# Altium schematic sheet meshBoard.SchDoc
size A0
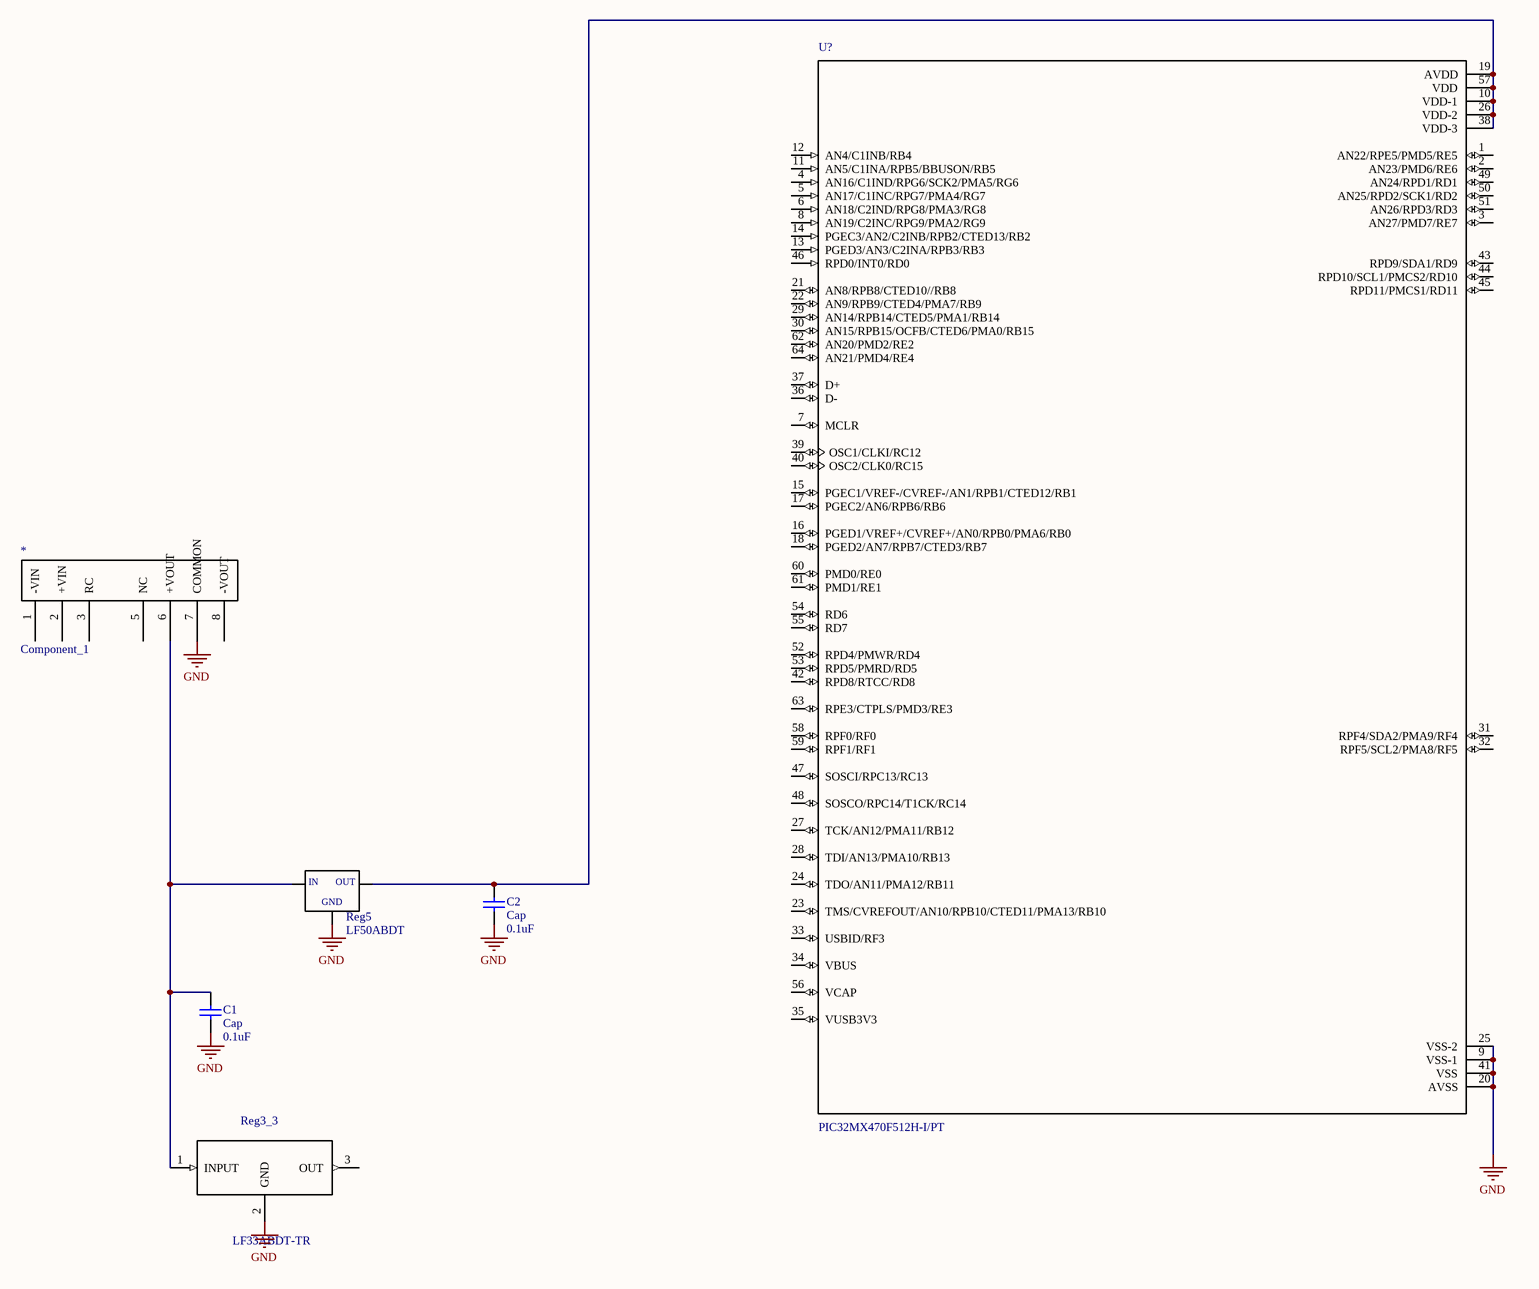
[diagram p0: meshBoard.SchDoc]

## Parts
*  Component_1
C1  Cap  value 0.1uF  [RAD-0.3]
C2  Cap  value 0.1uF  [RAD-0.3]
Reg3_3  LF33ABDT-TR  [*TO228P972X240-3N]
Reg5  LF50ABDT  [*DPAK]
U?  PIC32MX470F512H-I/PT  [*QFP50P1200X1200X120-64N]

## Nets
GND: *.7(COMMON) C1.1 C2.1 Reg3_3.2(GND) Reg5.4(GND) U?.9(VSS-1) U?.20(AVSS) U?.25(VSS-2) U?.41(VSS)
Net*_6: *.6(+VOUT) C1.2 Reg3_3.1(INPUT) Reg5.1(VIN)
NetC2_2: C2.2 Reg5.3(VOUT) U?.10(VDD-1) U?.19(AVDD) U?.26(VDD-2) U?.38(VDD-3) U?.57(VDD)

Not connected (* = marked no-connect by the designer): * 1(-VIN) 2(+VIN) 3(RC) 5(NC) 8(-VOUT); Reg3_3 3(OUT); U? 1(AN22/RPE5/PMD5/RE5) 2(AN23/PMD6/RE6) 3(AN27/PMD7/RE7) 4(AN16/C1IND/RPG6/SCK2/PMA5/RG6) 5(AN17/C1INC/RPG7/PMA4/RG7) 6(AN18/C2IND/RPG8/PMA3/RG8) 7(MCLR) 8(AN19/C2INC/RPG9/PMA2/RG9) 11(AN5/C1INA/RPB5/BBUSON/RB5) 12(AN4/C1INB/RB4) 13(PGED3/AN3/C2INA/RPB3/RB3) 14(PGEC3/AN2/C2INB/RPB2/CTED13/RB2) 15(PGEC1/VREF-/CVREF-/AN1/RPB1/CTED12/RB1) 16(PGED1/VREF+/CVREF+/AN0/RPB0/PMA6/RB0) 17(PGEC2/AN6/RPB6/RB6) 18(PGED2/AN7/RPB7/CTED3/RB7) 21(AN8/RPB8/CTED10//RB8) 22(AN9/RPB9/CTED4/PMA7/RB9) 23(TMS/CVREFOUT/AN10/RPB10/CTED11/PMA13/RB10) 24(TDO/AN11/PMA12/RB11) 27(TCK/AN12/PMA11/RB12) 28(TDI/AN13/PMA10/RB13) 29(AN14/RPB14/CTED5/PMA1/RB14) 30(AN15/RPB15/OCFB/CTED6/PMA0/RB15) 31(RPF4/SDA2/PMA9/RF4) 32(RPF5/SCL2/PMA8/RF5) 33(USBID/RF3) 34(VBUS) 35(VUSB3V3) 36(D-) 37(D+) 39(OSC1/CLKI/RC12) 40(OSC2/CLK0/RC15) 42(RPD8/RTCC/RD8) 43(RPD9/SDA1/RD9) 44(RPD10/SCL1/PMCS2/RD10) 45(RPD11/PMCS1/RD11) 46(RPD0/INT0/RD0) 47(SOSCI/RPC13/RC13) 48(SOSCO/RPC14/T1CK/RC14) 49(AN24/RPD1/RD1) 50(AN25/RPD2/SCK1/RD2) 51(AN26/RPD3/RD3) 52(RPD4/PMWR/RD4) 53(RPD5/PMRD/RD5) 54(RD6) 55(RD7) 56(VCAP) 58(RPF0/RF0) 59(RPF1/RF1) 60(PMD0/RE0) 61(PMD1/RE1) 62(AN20/PMD2/RE2) 63(RPE3/CTPLS/PMD3/RE3) 64(AN21/PMD4/RE4)

## Notes on the sheet
- (in symbol LF50ABDT) IN; OUT

## Library data of the parts
C1 C2 = Cap: Capacitor; Published: 8-Jun-2000; LatestRevisionDate: 17-Jul-2002; LatestRevisionNote: Re-released for DXP Platform.; PackageReference: RAD-0.3; Publisher: Altium Limited; PackageDescription: Radial Cap, Thru-Hole; 2 Leads; 0.3 in Pin Spacing
Reg3_3 = LF33ABDT-TR: LF33 Series 3.3 V 500 mA Very Low Drop Voltage Regulator with Inhibit - TO-252; MF: STMicroelectronics; Price: None; Package: TO-252 STMicroelectronics; Availability: Unavailable; MP: LF33ABDT-TR; SnapEDA_Link: https://www.snapeda.com/parts/LF33ABDT-TR/STMicroelectronics/view-part/?ref=snap; Value: *
Reg5 = LF50ABDT: Voltage stabiliser; LDO, fixed; 5V; 0.5A; DPAK; SMD; Package: rol; MP: LF50ABDT-TR; MF: STMicroelectronics; Package: TO-252-3 STMicroelectronics; Price: None; Availability: Unavailable; SnapEDA_Link: https://www.snapeda.com/parts/LF50ABDT-TR/STMicroelectronics/view-part/?ref=snap; Value: *
U? = PIC32MX470F512H-I/PT: 80MHz, 2 analog comp., 2I2C, 2SPI/I2S, 28 Ch. ADC, RTCC, DMA, PMP, 64 TQFP 10x10x1mm TRAY; MF: Microchip; Package: TQFP-64 Microchip; Price: None; SnapEDA_Link: https://www.snapeda.com/parts/PIC32MX470F512H-I/PT/Microchip/view-part/?ref=snap; Availability: Unavailable; MP: PIC32MX470F512H-I/PT; Value: *